# EAGLE design test-1 (EAGLE 7.5.0)
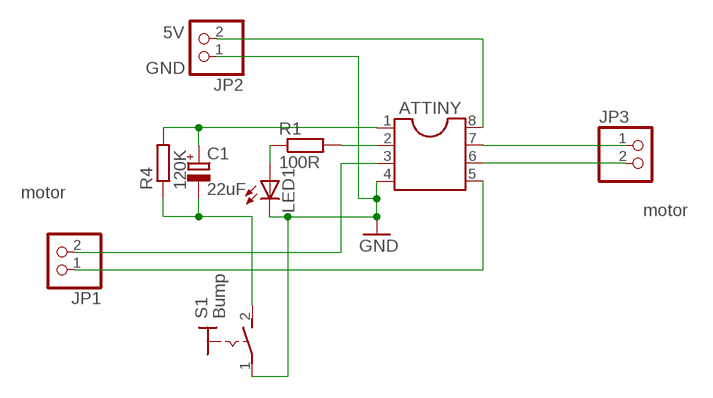
[diagram p0: schematic, sheet 1]

## Parts
ATTINY  DIL8  [DIL08]
C1  22uF  CPOL-EUE3.5-8  [E3,5-8]
JP1  PINHD-1X2  [1X02]
JP2  PINHD-1X2  [1X02]
JP3  PINHD-1X2  [1X02]
LED1  LED3MM  [LED3MM]
R1  100R  R-EU_0204/7  [0204/7]
R4  120K  R-EU_0204/7  [0204/7]
S1  Bump  MS243  [MS243]

## Nets
GND: ATTINY.4 JP2.1 LED1.K(C) S1.1(P)
N$2: ATTINY.2 R1.2
N$3: LED1.A R1.1
N$5: ATTINY.3 JP1.2
N$6: ATTINY.8 JP2.2
N$7: ATTINY.5 JP1.1
N$8: ATTINY.7 JP3.1
N$10: ATTINY.6 JP3.2
N$11: C1.- R4.1 S1.2(S)
RST: ATTINY.1 C1.+ R4.2

## Notes on the sheet
- 5V
- GND
- motor
- motor

## Library data of the parts
ATTINY = ic-package:DIL8: Dual In Line / Socket
C1 = rcl:CPOL-EU: POLARIZED CAPACITOR, European symbol
JP1-JP3 = opto:PINHD-1X2: PIN HEADER
LED1 = opto:LED: LED OSRAM: - CHIPLED LG R971, LG N971, LY N971, LG Q971, LY Q971, LO R971, LY R971 LH N974, LH R974 LS Q976, LO Q976, LY Q976 LO Q996 - Hyper CHIPLED LW Q18S LB Q993, LB Q99A, LB R99A - SideLED LS A670, LO A670, LY A670, LG A670, LP A670 LB A673, LV A673, LT A673, LW A673 LH A674 LY A675 LS A676, LA A676, LO A676, LY A676, LW A676 LS A679, LY A679, LG A679 - Hyper Micro SIDELED® LS Y876, LA Y876, LO Y876, LY Y876 LT Y87S - SmartLED LW L88C, LW L88S LB L89C, LB L89S, LG L890 LS L89K, LO L89K, LY L89K LS L896, LA L896, LO L896, LY L896 - TOPLED LS T670, LO T670, LY T670, LG T670, LP T670 LSG T670, LSP T670, LSY T670, LOP T670, LYG T670 LG T671, LOG T671, LSG T671 LB T673, LV T673, LT T673, LW T673 LH T674 LS T676, LA T676, LO T676, LY T676, LB T676, LH T676, LSB T676, LW T676 LB T67C, LV T67C, LT T67C, LS T67K, LO T67K, LY T67K, LW E67C LS E67B, LA E67B, LO E67B, LY E67B, LB E67C, LV E67C, LT E67C LW T67C LS T679, LY T679, LG T679 LS T770, LO T770, LY T770, LG T770, LP T770 LB T773, LV T773, LT T773, LW T773 LH T774 LS E675, LA E675, LY E675, LS T675 LS T776, LA T776, LO T776, LY T776, LB T776 LHGB T686 LT T68C, LB T68C - Hyper Mini TOPLED® LB M676 - Mini TOPLED Santana® LG M470 LS M47K, LO M47K, LY M47K Source: http://www.osram.convergy.de LUXEON: - LUMILED® LXK2-PW12-R00, LXK2-PW12-S00, LXK2-PW14-U00, LXK2-PW14-V00 LXK2-PM12-R00, LXK2-PM12-S00, LXK2-PM14-U00 LXK2-PE12-Q00, LXK2-PE12-R00, LXK2-PE12-S00, LXK2-PE14-T00, LXK2-PE14-U00 LXK2-PB12-K00, LXK2-PB12-L00, LXK2-PB12-M00, LXK2-PB14-N00, LXK2-PB14-P00, LXK2-PB14-Q00 LXK2-PR12-L00, LXK2-PR12-M00, LXK2-PR14-Q00, LXK2-PR14-R00 LXK2-PD12-Q00, LXK2-PD12-R00, LXK2-PD12-S00 LXK2-PH12-R00, LXK2-PH12-S00 LXK2-PL12-P00, LXK2-PL12-Q00, LXK2-PL12-R00 Source: www.luxeon.com KINGBRIGHT: KA-3528ASYC Source: www.kingbright.com
R1 R4 = opto:R-EU_: RESISTOR, European symbol
S1 = switch:MS243: TOGGLE SWITCH

## Board
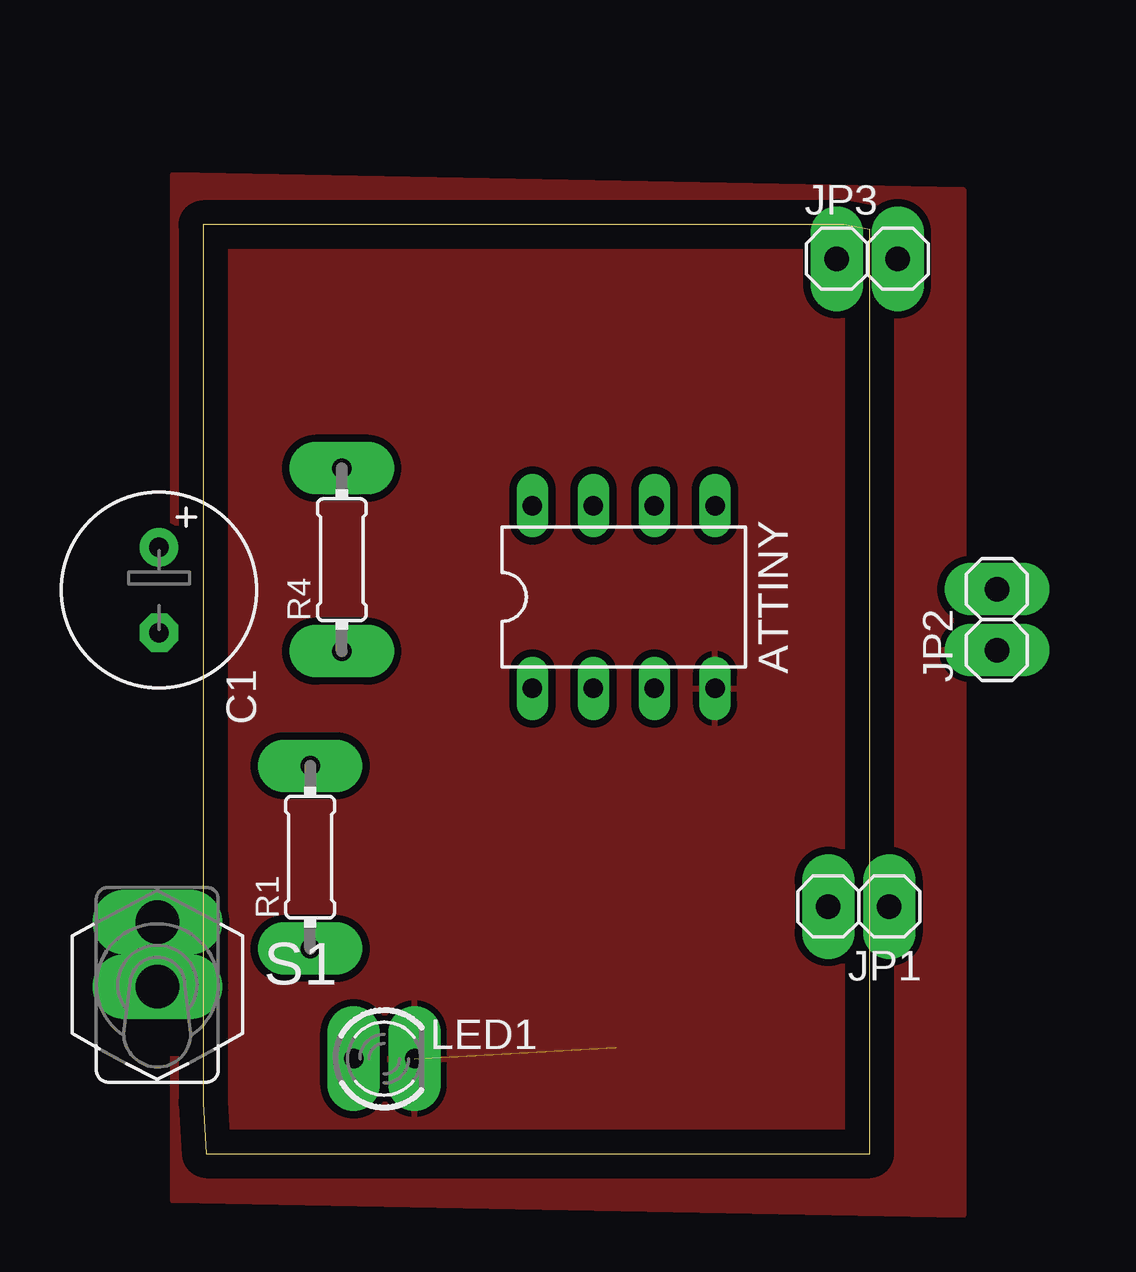
[diagram p1: board, top side]
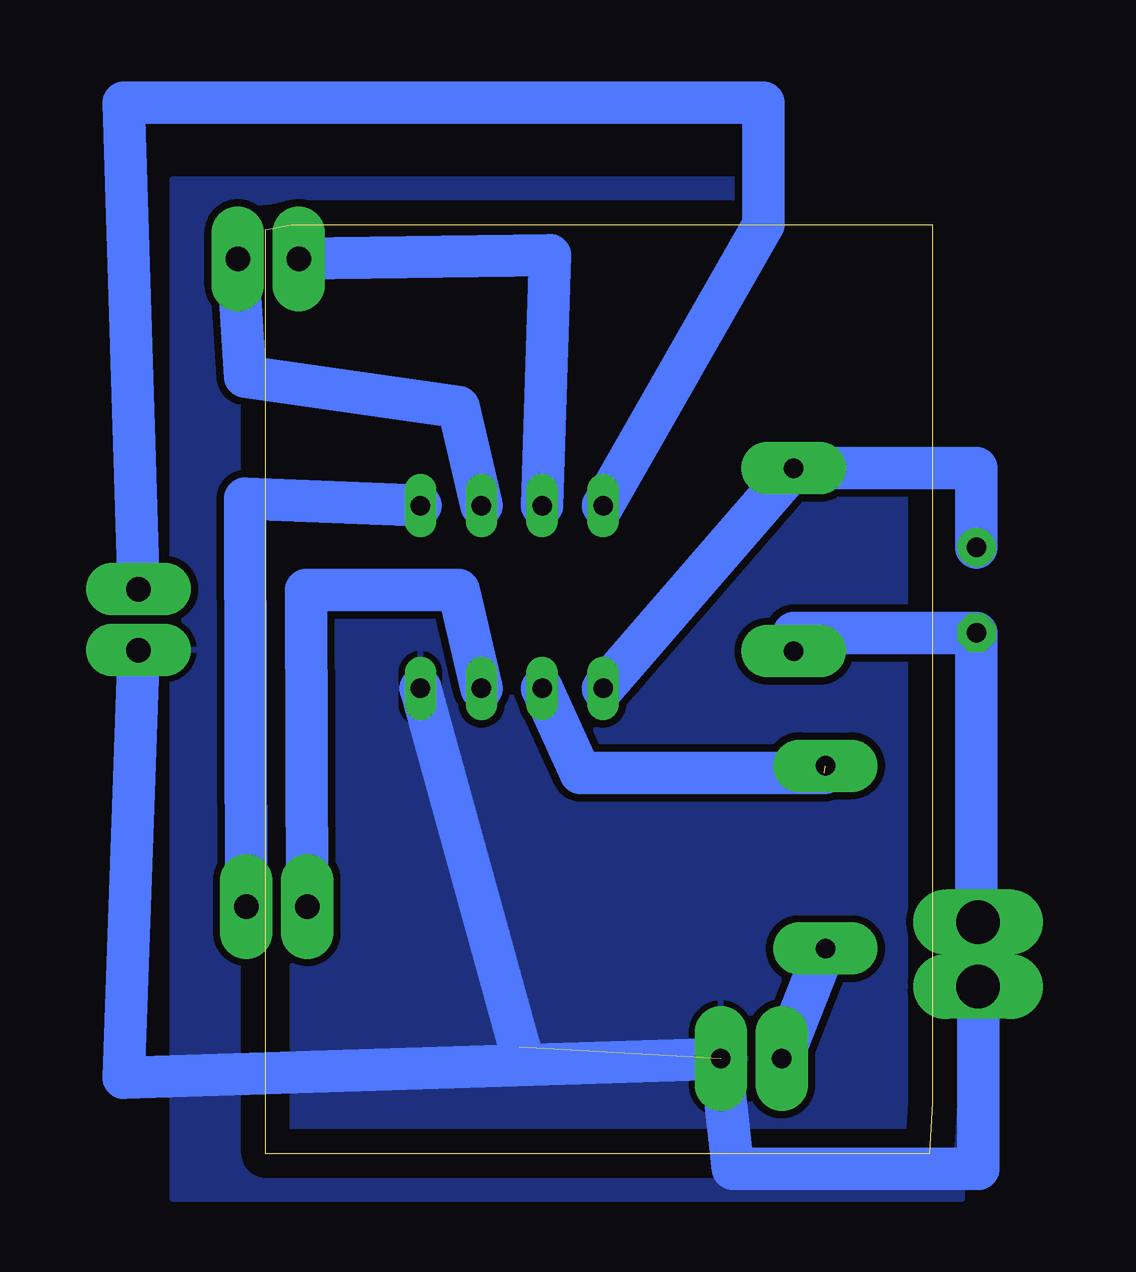
[diagram p2: board, bottom side, seen from below]

Size 27.8 x 38.73 mm. Coordinates in mm from the lower left corner, seen from the top.
Outline: 27.8,38.53 26.71,38.73 0.01,38.73 0,38.71 0,2.13 0.13,0 27.8,0 27.8,38.53
Copper layers (1*16): Top 0.035mm / dielectric 1.5mm / Bottom 0.035mm
Design rules "default *": minimum track width 10mil, minimum drill 24mil, track to track 12mil, track to pad 12mil, pad to pad 12mil, via to via 12mil, smd to smd 8mil, copper to edge 40mil, drill to drill 8mil, minimum pad ring 10mil, minimum via ring 8mil, stop-mask expansion 4mil, vias tented up to drill 0mil, thermal gap 10mil

### Footprints (pad centres in the part's own frame; a part is rotated, then mirrored left to right if it is on the bottom)
DIL08 = drill 0.813 long: 1 -3.81,-3.81; 2 -1.27,-3.81; 3 1.27,-3.81; 4 3.81,-3.81; 5 3.81,3.81; 6 1.27,3.81; 7 -1.27,3.81; 8 -3.81,3.81
E3,5-8 = drill 0.813 pad 1.6: + -1.778,0 | drill 0.813 pad 1.6 octagon: - 1.778,0
1X02 = drill 1.016 pad 2.184 long: 1 -1.27,0; 2 1.27,0
LED3MM = drill 0.813 pad 2.184 long: A -1.27,0; K 1.27,0
0204/7 = drill 0.813 pad 2.184 long: 1 -3.81,0; 2 3.81,0
MS243 = drill 1.803 pad 2 long: 1 0,-1.346; 2 0,1.346

### Placement (x,y rotation side)
ATTINY  17.54,23.21 0 top
C1  -1.83,23.5 270 top
JP1  27.34,10.3 180 top
JP2  33.09,22.27 90 top  (outside the outline)
JP3  27.69,37.3 0 top
LED1  7.55,3.96 0 top
R1  4.46,12.36 90 top
R4  5.79,24.77 90 top
S1  -1.9,8.31 0 top

### Tracks (layer width: path | path; a pad name or v marks a point on that pad's centre or on a via)
GND  (1 unrouted)
  Bottom 1.778: JP2.1 33.73,3.17 LED1.K 8.32,-0.64 -1.9,-0.64 S1.1 | ATTINY.4 17.21,4.45
  pour Top: -1.25,40.81 31.69,40.19 31.69,-2.57 -1.25,-1.95
  pour Bottom: -1.25,40.61 31.69,40.61 31.69,-1.88 -1.25,-1.88
N$2  (1 unrouted)
  Bottom 1.778: ATTINY.2 14.68,15.88 4.52,15.88
N$3
  Bottom 1.778: R1.1 LED1.A
N$5
  Bottom 1.778: ATTINY.3 19.75,23.5 26.11,23.5 JP1.2
N$6
  Bottom 1.778: ATTINY.8 7.05,38.73 7.05,43.81 33.73,43.81 JP2.2
N$7
  Bottom 1.778: JP1.1 28.65,27.3 ATTINY.5
N$8
  Bottom 1.778: JP3.1 15.95,37.46 ATTINY.7
N$10
  Bottom 1.778: ATTINY.6 19.75,31.12 28.65,32.38 JP3.2
N$11
  Bottom 1.778: S1.2 -1.83,9.66 C1.- 5.79,21.72 R4.1
RST
  Bottom 1.778: C1.+ -1.83,28.58 R4.2 ATTINY.1